# EAGLE design MainSensor (EAGLE 6.6.0)
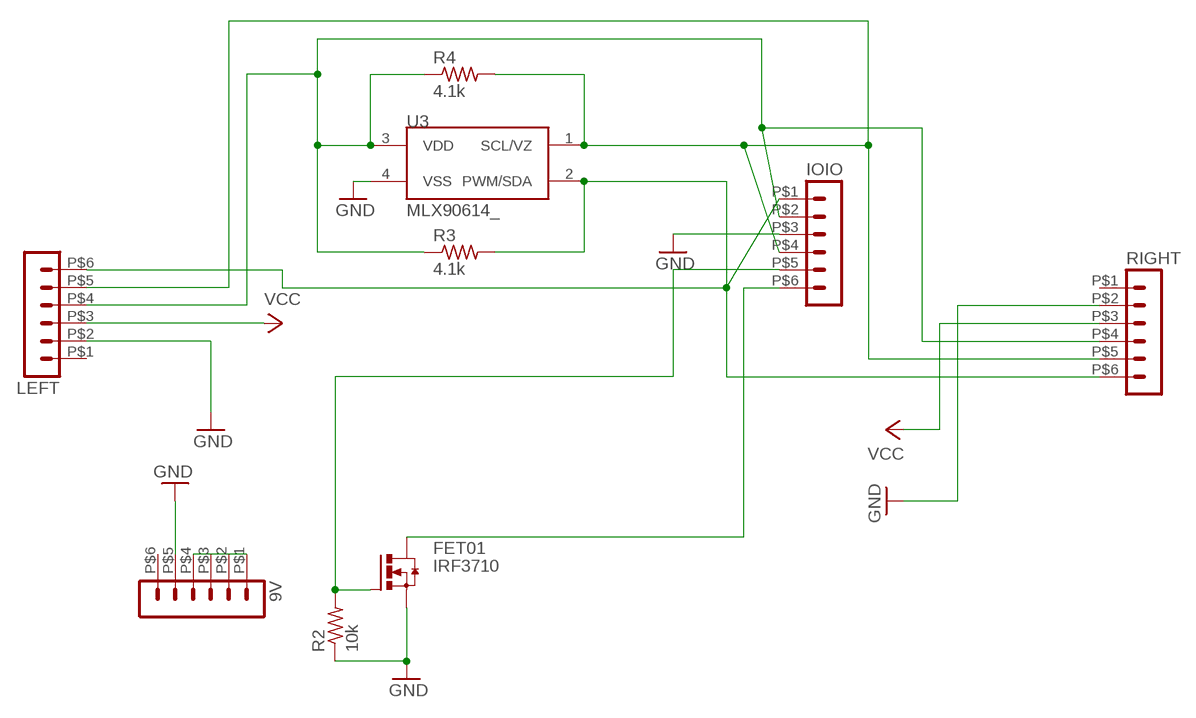
[diagram p0: schematic, sheet 1]

## Parts
9V  HEADER_POS6_43045-0600  [43045-0600]
FET01  IRF3710  IRF3704  [TO220AH]
IOIO  HEADER_POS6_43045-0600  [43045-0600]
LEFT  HEADER_POS6_43045-0600  [43045-0600]
R2  10k  R-US_0207/7  [0207/7]
R3  4.1k  R-US_0204/5  [0204/5]
R4  4.1k  R-US_0204/5  [0204/5]
RIGHT  HEADER_POS6_43045-0600  [43045-0600]
U3  MLX90614_  [TO-39]

## Nets
3.3V: IOIO.P$2 LEFT.P$4 R3.1 R4.1 RIGHT.P$4 U3.3(VDD)
GND: 9V.P$5 FET01.E(S) IOIO.P$3 LEFT.P$2 R2.1 RIGHT.P$2 U3.4(VSS)
IOIOPIN: FET01.B(G) IOIO.P$5 R2.2
N$1: 9V.P$1 9V.P$2 9V.P$3 9V.P$4
SCL: IOIO.P$4 LEFT.P$5 R4.2 RIGHT.P$5 U3.1(SCL/VZ)
SDA: IOIO.P$1 LEFT.P$6 R3.2 RIGHT.P$6 U3.2(PWM/SDA)
VCC: LEFT.P$3 RIGHT.P$3
VIB: FET01.C(D) IOIO.P$6
Unconnected: 9V.P$6 LEFT.P$1 RIGHT.P$1

## Library data of the parts
9V IOIO LEFT RIGHT = con-molex-micro-fit-3_0:HEADER_POS6_?: Molex - Micro-Fit 3.0 Series connector, 3.00mm (0.118") pitch header, 6 positions.
FET01 = transistor-power:IRF3704: SMPS MOSFET HEXFET® Power MOSFET Source: http://www.irf.com/product-info/datasheets/data/irf3704.pdf
R2-R4 = rcl:R-US_: RESISTOR, American symbol
U3 = SparkFun-Sensors:MLX90614: Non-contact PIR I2C interface temperature sensor

## Net classes
0 default: width 0.61 mm, drill 1.27 mm, clearance 0.508 mm

## Board
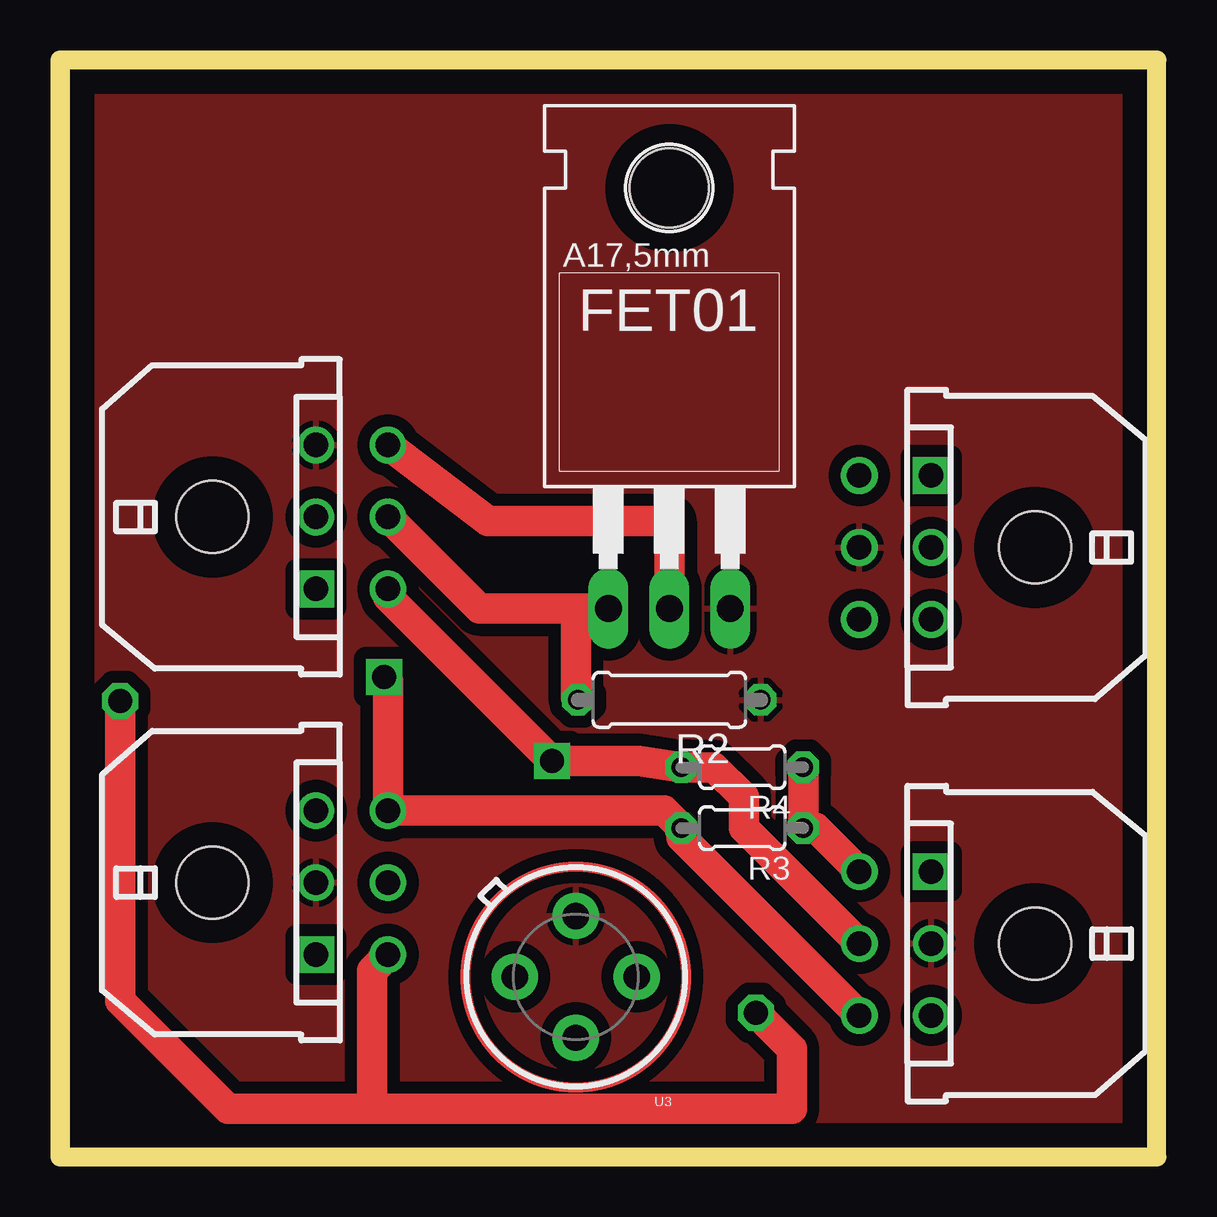
[diagram p1: board, top side]
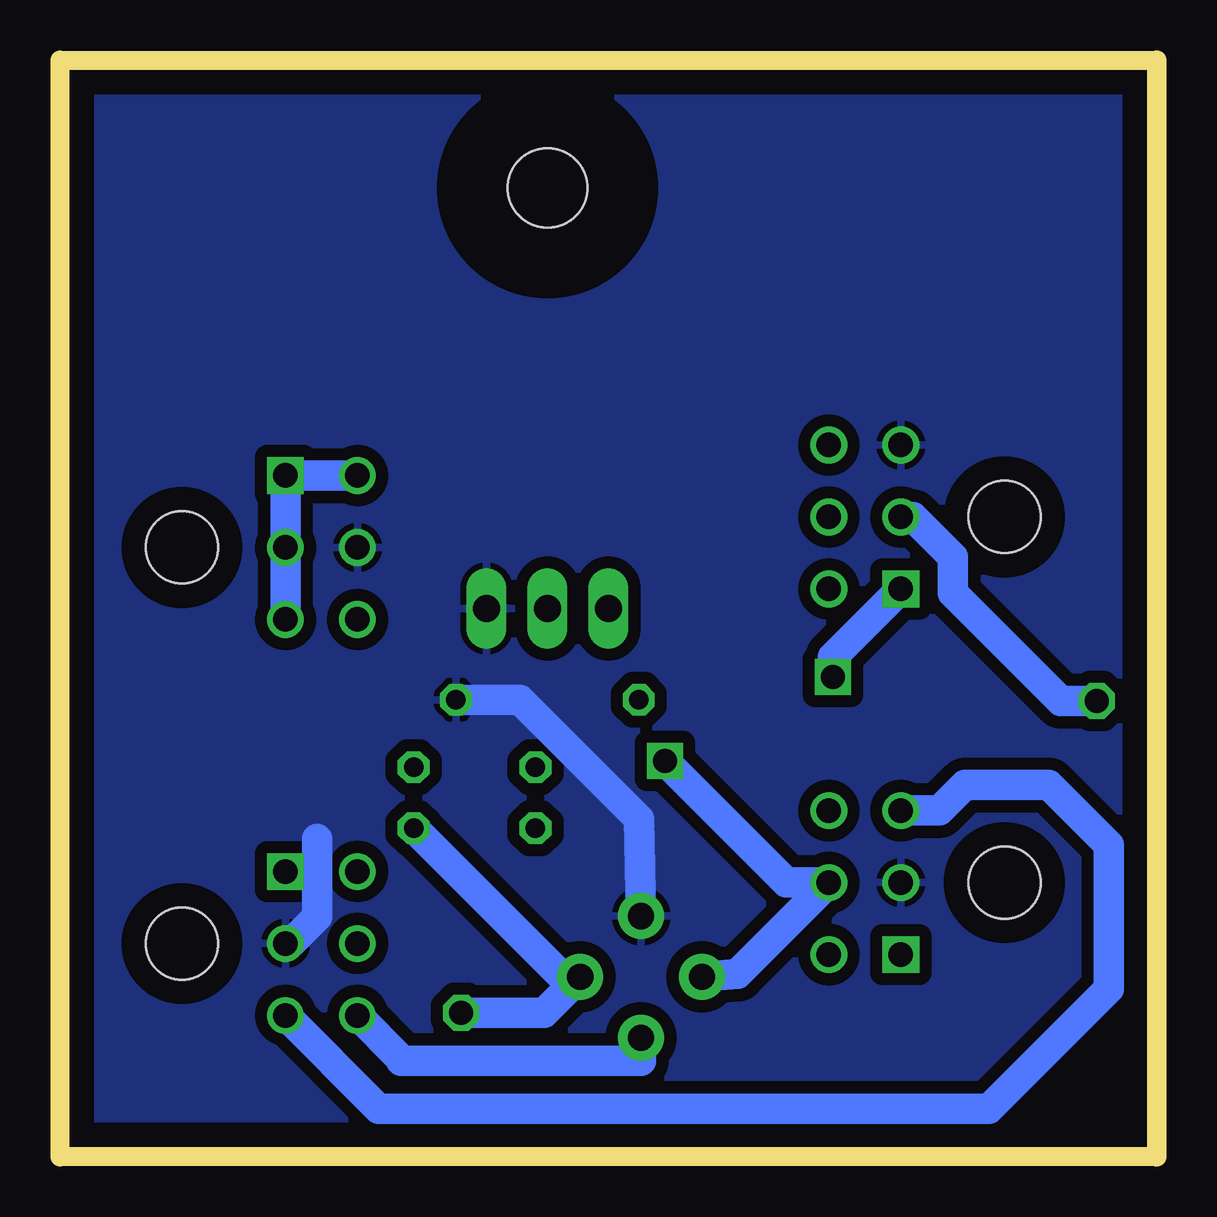
[diagram p2: board, bottom side, seen from below]

Size 45.72 x 45.72 mm. Coordinates in mm from the lower left corner, seen from the top.
Outline: 0,0 45.72,0 45.72,45.72 0,45.71 0,0
Copper layers (1*16): Top 0.035mm / dielectric 1.5mm / Bottom 0.035mm
Design rules "default *": minimum track width 5mil, minimum drill 24mil, track to track 8mil, track to pad 8mil, pad to pad 8mil, via to via 8mil, smd to smd 8mil, copper to edge 40mil, drill to drill 8mil, minimum pad ring 10mil, minimum via ring 8mil, stop-mask expansion 4mil, vias tented up to drill 0mil, thermal gap 10mil

### Footprints (pad centres in the part's own frame; a part is rotated, then mirrored left to right if it is on the bottom)
43045-0600 = drill 1.02 square: P$1 3,4.32 | drill 1.02: P$2 0,4.32; P$3 -3,4.32; P$4 3,7.32; P$5 0,7.32; P$6 -3,7.32 | hole 3: 0,0
TO220AH = drill 1.118 long: B -2.54,-6.35; C 0,-6.35; E 2.54,-6.35 | hole 3.302: 0,11.176
0207/7 = drill 0.813 octagon: 1 -3.81,0; 2 3.81,0
0204/5 = drill 0.813 octagon: 1 -2.54,0; 2 2.54,0
TO-39 = drill 1.1 pad 1.93: 1 2.54,0; 2 0,2.54; 3 -2.54,0; 4 0,-2.54

### Placement (x,y rotation side)
9V  40.64,25.4 90 top
FET01  25.4,29.21 0 top
IOIO  6.35,26.67 270 top
LEFT  6.35,11.43 270 top
R2  25.4,19.05 180 top
R3  28.44,13.7 180 top
R4  28.44,16.24 180 top
RIGHT  40.64,8.89 90 top
U3  21.5,7.5 180 top

### Tracks (layer width: path | path; a pad name or v marks a point on that pad's centre or on a via)
3.3V  (via drill 1)
  Top 1.27: R4.1 R3.1 31.51,13.7 RIGHT.P$4 | v29,6 30.5,4.5 30.5,2 13,2 | v2.5,19 2.5,6.5 7,2 13,2 | LEFT.P$4 13,7.76 13,2
  Bottom 1.27: R3.1 24.78,7.5 U3.3 25.54,6 v29,6 | IOIO.P$2 10.17,26.67 8.5,25 8.5,23.5 4,19 v2.5,19
GND
  Bottom 1.27: RIGHT.P$2 36.11,8.89 35,10 35,13.26 | U3.4 21.59,14.09 26.55,19.05 R2.1
  pour Bottom (isolate 0.406): -1.27,46.99 46.99,46.99 46.99,-1.27 -1.27,-1.27
  pour Top (isolate 0.406): -1.27,46.99 46.99,46.99 46.99,-1.27 -1.27,-1.27
IOIOPIN
  Top 1.27: IOIO.P$5 17.48,22.86 21.5,22.86 | 21.5,22.86 FET01.B | R2.2 21.5,19.14 21.5,22.86
N$1
  Bottom 1.27: 9V.P$3 9V.P$2 9V.P$1 9V.P$4
SCL  (via drill 1)
  Top 1.27: IOIO.P$4 13.67,23.33 v20.5,16.5 24.14,16.5 R4.2 27.26,16.24 28.5,15 28.5,13.71 RIGHT.P$5
  Bottom 1.27: U3.1 17.48,7.62 LEFT.P$5 15.43,11.43 v20.5,16.5
SDA  (via drill 1)
  Top 1.27: v13.5,20 13.67,19.83 LEFT.P$6 25.17,14.43 R3.2 25.9,13.31 RIGHT.P$6
  Bottom 1.27: v13.5,20 13.5,20.84 IOIO.P$1 | U3.2 21.5,4 31.5,4 31.5,4.07 RIGHT.P$6
VCC
  Bottom 1.27: LEFT.P$3 9.07,14.43 8,15.5 4.5,15.5 2,13 2,7 7,2 32.43,2 RIGHT.P$3
VIB
  Top 1.27: IOIO.P$6 17.84,26.5 25.4,26.5 FET01.C
(copper drawn outside any net)
  shapes: Top circle x1